# Altium schematic sheet Power.SchDoc
size A4; Author: Audran; CompanyName: Goldorak; Address1: Electrolab; Address2: 52 rue Paul Lescop; Address3: 92000 Nanterre; DocumentNumber: 4; SheetNumber: 4; SheetTotal: 8; ProjectName: Cartes_2017
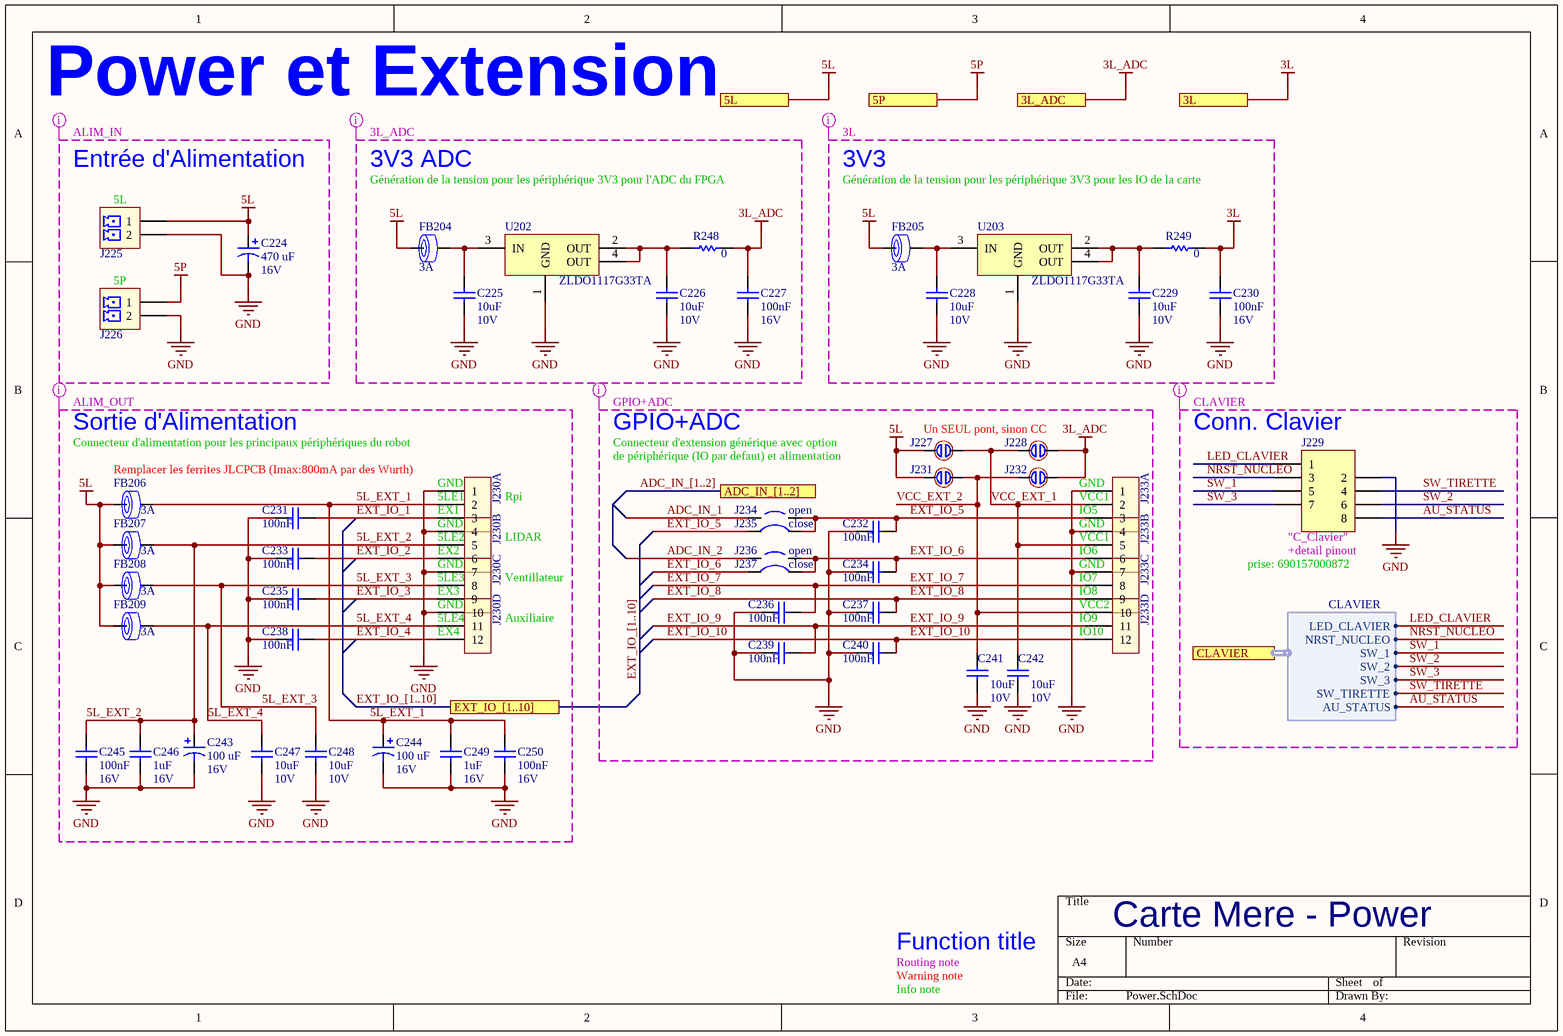
[diagram p0: Power.SchDoc]

## Parts
C224  470 uF  RatedVoltage: 16V  [WCAP-ATG8_8x11.5x3.5x0.5]
C225  10uF  RatedVoltage: 10V  [WCAP-CSGP_0805, 2x1.25x1.25]
C226  10uF  RatedVoltage: 10V  [WCAP-CSGP_0805, 2x1.25x1.25]
C227  100nF  RatedVoltage: 16V  [WCAP-CSGP_0402, 1x0.5x0.5]
C228  10uF  RatedVoltage: 10V  [WCAP-CSGP_0805, 2x1.25x1.25]
C229  10uF  RatedVoltage: 10V  [WCAP-CSGP_0805, 2x1.25x1.25]
C230  100nF  RatedVoltage: 16V  [WCAP-CSGP_0402, 1x0.5x0.5]
C231  100nF  [WCAP-CSGP_0402, 1x0.5x0.5]
C232  100nF  [WCAP-CSGP_0402, 1x0.5x0.5]
C233  100nF  [WCAP-CSGP_0402, 1x0.5x0.5]
C234  100nF  [WCAP-CSGP_0402, 1x0.5x0.5]
C235  100nF  [WCAP-CSGP_0402, 1x0.5x0.5]
C236  100nF  [WCAP-CSGP_0402, 1x0.5x0.5]
C237  100nF  [WCAP-CSGP_0402, 1x0.5x0.5]
C238  100nF  [WCAP-CSGP_0402, 1x0.5x0.5]
C239  100nF  [WCAP-CSGP_0402, 1x0.5x0.5]
C240  100nF  [WCAP-CSGP_0402, 1x0.5x0.5]
C241  10uF  RatedVoltage: 10V  [WCAP-CSGP_0805, 2x1.25x1.25]
C242  10uF  RatedVoltage: 10V  [WCAP-CSGP_0805, 2x1.25x1.25]
C243  100 uF  RatedVoltage: 16V  [WCAP-ATG8_5x11x2x0.5]
C244  100 uF  RatedVoltage: 16V  [WCAP-ATG8_5x11x2x0.5]
C245  100nF  RatedVoltage: 16V  [WCAP-CSGP_0402, 1x0.5x0.5]
C246  1uF  RatedVoltage: 16V  [WCAP-CSGP_0603, 1.6x0.8x0.8]
C247  10uF  RatedVoltage: 10V  [WCAP-CSGP_0805, 2x1.25x1.25]
C248  10uF  RatedVoltage: 10V  [WCAP-CSGP_0805, 2x1.25x1.25]
C249  1uF  RatedVoltage: 16V  [WCAP-CSGP_0603, 1.6x0.8x0.8]
C250  100nF  RatedVoltage: 16V  [WCAP-CSGP_0402, 1x0.5x0.5]
FB204  RatedCurrent: 3A  [WE-CBF_0805_High Current]  (hidden comment: 742792023)
FB205  RatedCurrent: 3A  [WE-CBF_0805_High Current]  (hidden comment: 742792023)
FB206  RatedCurrent: 3A  [WE-CBF_0805_High Current]  (hidden comment: 742792023)
FB207  RatedCurrent: 3A  [WE-CBF_0805_High Current]  (hidden comment: 742792023)
FB208  RatedCurrent: 3A  [WE-CBF_0805_High Current]  (hidden comment: 742792023)
FB209  RatedCurrent: 3A  [WE-CBF_0805_High Current]  (hidden comment: 742792023)
J225  691322110002  [691322110002]  (value not drawn)
J226  691322110002  [691322110002]  (value not drawn)
J227  open  [CAVALIER]  (value not drawn)  (no BOM)
J228  open  [CAVALIER]  (value not drawn)  (no BOM)
J229  690367280876  [690367280876]  (value not drawn)
J230  TSW-104-08-F-T-RA  [TSW-104-08-F-T-RA]  (value not drawn)  (parts A,B,C,D of 4)
J231  open  [CAVALIER]  (value not drawn)  (no BOM)
J232  open  [CAVALIER]  (value not drawn)  (no BOM)
J233  TSW-104-08-F-T-RA  [TSW-104-08-F-T-RA]  (value not drawn)  (parts A,B,C,D of 4)
J234  open  [CAVALIER_0603_O]  (net tie, no BOM)
J235  close  [CAVALIER_0603_C]  (net tie, no BOM)
J236  open  [CAVALIER_0603_O]  (net tie, no BOM)
J237  close  [CAVALIER_0603_C]  (net tie, no BOM)
R248  value 0  [RESC1608X06N]  (hidden comment: RC0603FR-070RL)
R249  value 0  [RESC1608X06N]  (hidden comment: RC0603FR-070RL)
U202  ZLDO1117G33TA  [SOT223]
U203  ZLDO1117G33TA  [SOT223]

## Ports
3L, 3L_ADC, 5L, 5P, ADC_IN_[1..2], CLAVIER (harness CLAVIER), EXT_IO_[1..10]

## Harnesses
CLAVIER: LED_CLAVIER, NRST_NUCLEO, SW_1, SW_2, SW_3, SW_TIRETTE, AU_STATUS

## Nets
3L: C230.1 R249.2 ; port 3L
3L_ADC: C227.1 J228.1 J232.1 R248.2 ; port 3L_ADC
5L: C224.1 FB204.1 FB205.1 FB206.1 FB207.1 FB208.1 FB209.1 J225.1 J227.2 J231.2 ; port 5L
5P: J226.1 ; port 5P
GND: C224.2 C225.2 C226.2 C227.2 C228.2 C229.2 C230.2 C231.2 C232.2 C233.2 C234.2 C235.2 C236.2 C237.2 C238.2 C239.2 C240.2 C241.2 C242.2 C243.2 C244.2 C245.2 C246.2 C247.2 C248.2 C249.2 C250.2 J225.2 J226.2 J229.2 J230.1 J230.4 J230.7 J230.10 J233.1 J233.4 J233.7 U202.1(GND) U203.1(GND)
5L_EXT_1: C244.1 C249.1 C250.1 FB206.2 J230.2
5L_EXT_2: C243.1 C245.1 C246.1 FB207.2 J230.5
5L_EXT_3: C248.1 FB208.2 J230.8
5L_EXT_4: C247.1 FB209.2 J230.11
ADC_IN_1: J234.1
ADC_IN_2: J236.1
AU_STATUS: J229.8 ; port CLAVIER.AU_STATUS
EXT_IO_1: C231.1 J230.3
EXT_IO_2: C233.1 J230.6
EXT_IO_3: C235.1 J230.9
EXT_IO_4: C238.1 J230.12
EXT_IO_5: C232.1 J233.3 J234.2 J235.1 J235.2
EXT_IO_6: C234.1 J233.6 J236.2 J237.1 J237.2
EXT_IO_7: C236.1 J233.8
EXT_IO_8: C237.1 J233.9
EXT_IO_9: C239.1 J233.11
EXT_IO_10: C240.1 J233.12
LED_CLAVIER: J229.1 ; port CLAVIER.LED_CLAVIER
NRST_NUCLEO: J229.3 ; port CLAVIER.NRST_NUCLEO
SW_1: J229.5 ; port CLAVIER.SW_1
SW_2: J229.6 ; port CLAVIER.SW_2
SW_3: J229.7 ; port CLAVIER.SW_3
SW_TIRETTE: J229.4 ; port CLAVIER.SW_TIRETTE
VCC_EXT_1: C242.1 J227.1 J228.2 J233.2 J233.5
VCC_EXT_2: C241.1 J231.1 J232.2 J233.10
NetC225_1: C225.1 FB204.2 U202.3(IN)
NetC226_1: C226.1 R248.1 U202.2(OUT) U202.4(OUT)
NetC228_1: C228.1 FB205.2 U203.3(IN)
NetC229_1: C229.1 R249.1 U203.2(OUT) U203.4(OUT)

## Buses and harness runs
bus ADC_IN_[1..2] = port ADC_IN_[1..2]
bus EXT_IO_[1..10] = port EXT_IO_[1..10]

## Layout directives
net class GPIO+ADC: 3L_ADC, 5L, ADC_IN_1, ADC_IN_2, ADC_IN_[1..2], EXT_IO_5, EXT_IO_6, EXT_IO_7, EXT_IO_8, EXT_IO_9, EXT_IO_10, EXT_IO_[1..10], GND, VCC_EXT_1, VCC_EXT_2
net class ALIM_OUT: 5L, 5L_EXT_1, 5L_EXT_2, 5L_EXT_3, 5L_EXT_4, EXT_IO_1, EXT_IO_2, EXT_IO_3, EXT_IO_4, EXT_IO_[1..10], GND
net class ALIM_IN: 5L, 5P, GND
net class 3L_ADC: 3L_ADC, 5L, GND
net class 3L: 3L, 5L, GND
net class CLAVIER: AU_STATUS, GND, LED_CLAVIER, NRST_NUCLEO, SW_1, SW_2, SW_3, SW_TIRETTE

## Notes on the sheet
- Power et Extension
- Entrée d'Alimentation
- 3V3 ADC
- 3V3
- (near J225) 5L
- Génération de la tension pour les périphérique 3V3 pour l'ADC du FPGA
- Génération de la tension pour les périphérique 3V3 pour les IO de la carte
- (near J226) 5P
- Sortie d'Alimentation
- Connecteur d'alimentation pour les principaux périphériques du robot
- GPIO+ADC
- Connecteur d'extension générique avec option
- Un SEUL pont, sinon CC
- (near J229) Conn. Clavier
- Remplacer les ferrites JLCPCB (Imax:800mA par des Wurth)
- (near J230) 5LE1
- (near J230) GND
- (near J230) EX1
- (near J230) Rpi
- de périphérique (IO par defaut) et alimentation
- (near J233) IO5
- (near J233) VCC1
- (near J233) GND
- (near J230) 5LE2
- (near J230) 5LE3
- (near J230) EX2
- (near J230) LIDAR
- (near J230) Ventillateur
- (near J233) IO6
- (near J233) IO7
- (near J229) prise: 690157000872
- (near J229) "C_Clavier"
- (near J229) +detail pinout
- (near J230) 5LE4
- (near J230) EX3
- (near J230) EX4
- (near J230) Auxiliaire
- (near J233) IO8
- (near J233) IO9
- (near J233) IO10
- (near J233) VCC2
- Routing note
- Warning note
- Function title
- Carte Mere - Power
- Info note

## Library data of the parts
C224 = WCAP-ATG8, 860010374012: CAP Alu 470 UF 20% 16 V; Manufacturer: Wurth Elektronik; ComponentLink1Description: Datasheet; ComponentLink1URL: http://katalog.we-online.de/pbs/datasheet/860010374012.pdf; Manufacturer Part Number: 860010374012; Value: 470 uF; Size: 8mmx11.5mm
C225 C226 C228 C229 C241 C242 C247 C248 = WCAP-CSGP, 885012207026: CAP CER 10uF 10V X7R 0805; Manufacturer: Wurth Elektronik; ComponentLink1Description: Datasheet; ComponentLink1URL: http://katalog.we-online.com/pbs/datasheet/885012207026.pdf; Manufacturer Part Number: 885012207026; Value: 10uF; Size: 0805; CeramicType: X7R; Supplier 1: Farnell; Supplier Part Number 1: 2495189; Supplier Part Number 2: C15850; Supplier 2: JLCPCB; Supplier Footprint 2: 0805
C227 C230-C240 C245 C250 = WCAP-CSGP, 885012205037: CAP CER 100nF 16V X7R 0402; Manufacturer: Wurth Elektronik; ComponentLink1Description: Datasheet; ComponentLink1URL: http://katalog.we-online.com/pbs/datasheet/885012205037.pdf; Manufacturer Part Number: 885012205037; Value: 100nF; Size: 0402; CeramicType: X7R; Supplier 2: JLCPCB; Supplier Part Number 2: C1525; Supplier Footprint 2: 0402
  C231-C240: RatedVoltage: 16V
C243 C244 = WCAP-ATG8, 860010372006: CAP Alu 100 UF 20% 16 V; Manufacturer: Wurth Elektronik; ComponentLink1Description: Datasheet; ComponentLink1URL: http://katalog.we-online.de/pbs/datasheet/860010372006.pdf; Manufacturer Part Number: 860010372006; Value: 100 uF; Size: 5mmx11mm
C246 C249 = WCAP-CSGP, 885012106017: CAP CER 1UF 16V X5R 0603; Manufacturer: Wurth Elektronik; ComponentLink1Description: Datasheet; ComponentLink1URL: http://katalog.we-online.com/pbs/datasheet/885012106017.pdf; Manufacturer Part Number: 885012106017; Value: 1uF; Size: 0603; CeramicType: X5R; Supplier 2: JLCPCB; Supplier Part Number 2: C15849; Supplier Footprint 2: 0603
FB204-FB209 = WE-CBF, 742792023: Ferrite Bead 120ohm 0805 3A; Manufacturer: Wurth Elektronik; Value: 120; ComponentLink1Description: Manufacturer; ComponentLink1URL: https://www.we-online.com/catalog/en/WE-CBF/?sq=742792023#742792023; ComponentLink2Description: Datasheet; ComponentLink2URL: https://www.we-online.com/catalog/datasheet/742792023.pdf; Manufacturer Part Number: 742792023; Supplier 2: JLCPCB; Supplier Part Number 2: C1015; Supplier 1: Farnell; Supplier Part Number 1: 1635732; Supplier Footprint 2: 0805
J225 J226 = 691322110002: WR-TBL 2p Series 3221 - 3.50 mm Horizontal PCB Header; Manufacturer: Wurth Electronics Inc.; Value: 2; Supplier 1: Farnell; Manufacturer Part Number: 691322110002; ComponentLink1URL: http://katalog.we-online.de/em/datasheet/6913221100xx.pdf; ComponentLink1Description: Datasheet; Supplier Part Number 1: 1841315
J227 J228 J231 J232 = CAVALIER_DOT: Cavalier soudure "ouvert", pastille fendue 1.2mm
J229 = 690367280876: WR-MM 8p Female SMT Connector with Polarization; Manufacturer: Wurth Electronics Inc.; Value: 8; Manufacturer Part Number: 690367280876; ComponentLink1Description: Datasheet; ComponentLink1URL: http://katalog.we-online.de/em/datasheet/69036728xx76.pdf; Supplier 1: Farnell; Supplier Part Number 1: 1641850
J230 J233 = TSW-104-08-F-T-RA: CONN HEADER R/A 3L x 4POS 2.54MM; Manufacturer: SAMTEC; Manufacturer Part Number: TSW-104-08-F-T-RA; Supplier 1: Farnell; Supplier Part Number 1: 2053041; ComponentLink1Description: Datasheet; ComponentLink1URL: http://cloud.samtec.com/catalog_english/TSW_TH.PDF
J234 J236 = CAVALIER_0603_O: Cavalier soudure "ouvert" + empreinte dipole 0603
J235 J237 = CAVALIER_0603_C: Cavalier soudure "fermé" + empreinte dipole 0603
R248 R249 = RC0603FR-070RL: RES SMD 0 OHM 1% 1/10W 0603; Manufacturer: Yageo; Power: 100mW; Vmax: 50V; Manufacturer Part Number: RC0603FR-070RL; Type: Thick Film; ComponentLink1Description: Manufacturer; ComponentLink1URL: http://www.yageo.com/NewPortal/_en/index.jsp; ComponentLink2Description: Datasheet; ComponentLink2URL: http://www.farnell.com/datasheets/2167052.pdf; Supplier 1: Farnell; Precision: ±1%; Supplier Part Number 1: 2309106; Supplier 2: JLCPCB; Supplier Part Number 2: C21189; Supplier Footprint 2: 0603
U202 U203 = ZLDO1117G33TA: LDO 3.3V 1A SOT223-3; Manufacturer: Diodes Inc.; Manufacturer Part Number: ZLDO1117G33TA; ComponentLink1URL: http://www.farnell.com/datasheets/1769101.pdf; ComponentLink1Description: Datasheet; ComponentLink2Description: Manufacturer; ComponentLink2URL: https://www.diodes.com/part/view/ZLDO1117; Type: LDO; Value: 3.3V; Supplier 2: JLCPCB; Supplier Part Number 2: C6186; Supplier 1: Farnell; Supplier Part Number 1: 1825376; Supplier Footprint 2: SOT-223